# Altium project smove.PrjPcb
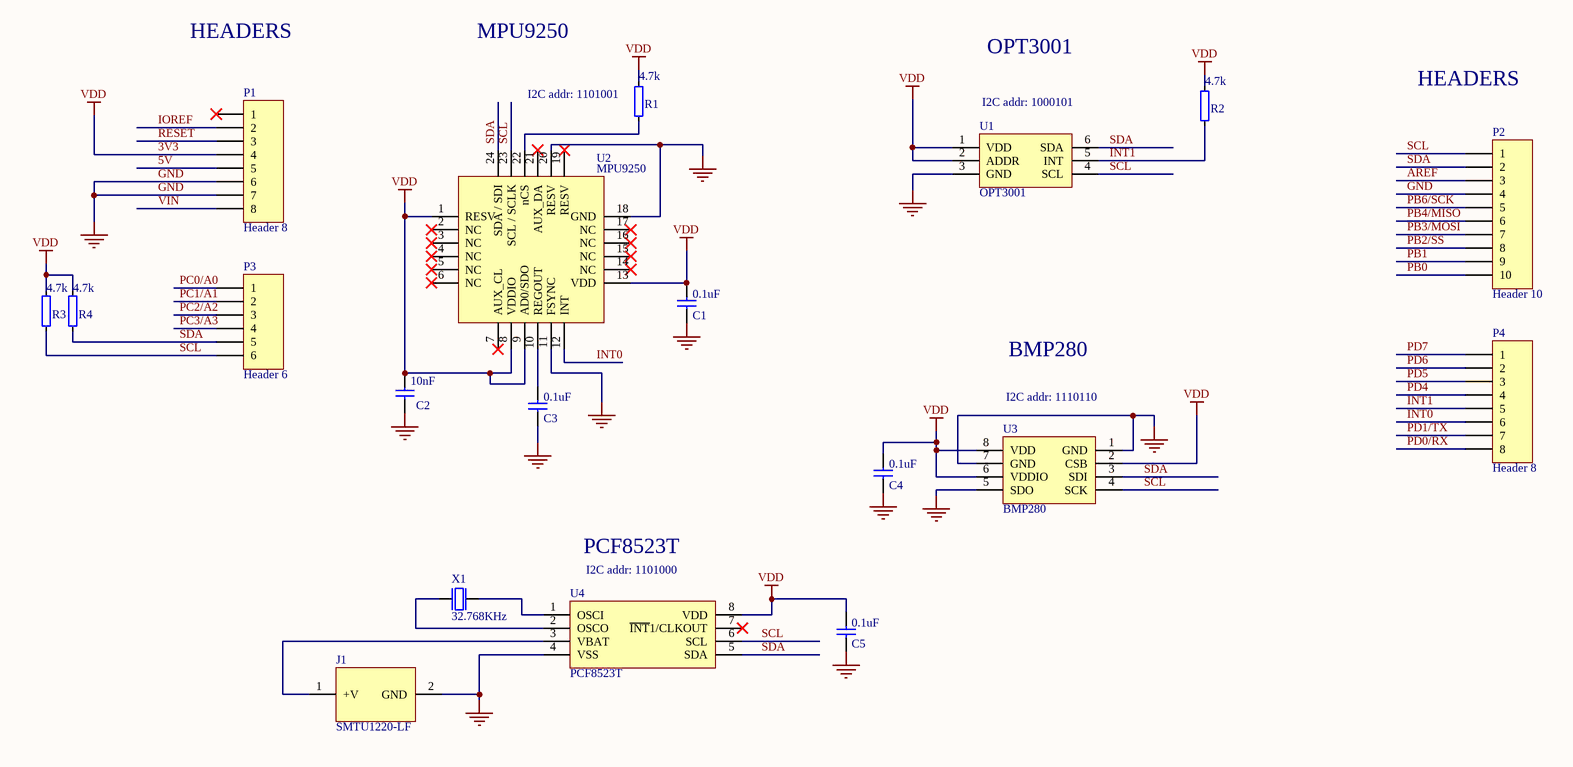
[diagram p0: Sheet1.SchDoc]
1 sheet, 19 parts. Net scope: global (net labels, ports and power ports of the same name join across sheets).
Board file: PCB1.PcbDoc

## Sheet Sheet1.SchDoc
size A3

### Parts
C1  0.1uF  [CAPC1608X06L]
C2  10nF  [CAPC1608X06L]
C3  0.1uF  [CAPC1608X06L]
C4  0.1uF  [CAPC1608X06L]
C5  0.1uF  [CAPC1608X06L]
J1  SMTU1220-LF  [SMTU1220-LF]
P1  Header 8  [HDR1X8]
P2  Header 10  [HDR1X10]
P3  Header 6  [HDR1X6]
P4  Header 8  [HDR1X8]
R1  4.7k  [RESC1608X06N]
R2  4.7k  [RESC1608X06N]
R3  4.7k  [RESC1608X06N]
R4  4.7k  [RESC1608X06N]
U1  OPT3001  [SON65P200X65_HS-7N]
U2  MPU9250  [QFN40P300X300X105_HS-25N]
U3  BMP280  [SON65P200X100-8N]
U4  PCF8523T  [SOIC127P600X175-8N]
X1  32.768KHz  [XTAL_3215]

### Nets
3V3: C1.2 C2.2 C4.2 C5.2 P1.4 R1.2 R2.2 R3.2 R4.2 U1.1(VDD) U1.2(ADDR) U2.1(RESV) U2.8(VDDIO) U2.9(AD0/SDO) U2.13(VDD) U3.2(CSB) U3.6(VDDIO) U3.8(VDD) U4.8(VDD)  [also labelled VDD]
GND: C1.1 C2.1 C3.1 C4.1 C5.1 J1.2(GND) P1.6 P1.7 P2.4 U1.3(GND) U2.11(FSYNC) U2.18(GND) U2.20(RESV) U3.1(GND) U3.5(SDO) U3.7(GND) U4.4(VSS)
5V: P1.5
AREF: P2.3
INT0: P4.6 U2.12(INT)
INT1: P4.5 R2.1 U1.5(INT)
IOREF: P1.2
PB0: P2.10
PB1: P2.9
PB2/SS: P2.8
PB3/MOSI: P2.7
PB4/MISO: P2.6
PB6/SCK: P2.5
PC0/A0: P3.1
PC1/A1: P3.2
PC2/A2: P3.3
PC3/A3: P3.4
PD0/RX: P4.8
PD1/TX: P4.7
PD4: P4.4
PD5: P4.3
PD6: P4.2
PD7: P4.1
RESET: P1.3
SCL: P2.1 P3.6 R3.1 U1.4(SCL) U2.23(SCL_/_SCLK) U3.4(SCK) U4.6(SCL)
SDA: P2.2 P3.5 R4.1 U1.6(SDA) U2.24(SDA_/_SDI) U3.3(SDI) U4.5(SDA)
VIN: P1.8
NetC3_2: C3.2 U2.10(REGOUT)
NetJ1_1: J1.1(+V) U4.3(VBAT)
NetR1_1: R1.1 U2.22(nCS)
NetU4_1: U4.1(OSCI) X1.2(out)
NetU4_2: U4.2(OSCO) X1.1(inp)

Not connected (* = marked no-connect by the designer): P1 1*; U2 2(NC)* 3(NC)* 4(NC)* 5(NC)* 6(NC)* 7(AUX_CL)* 14(NC)* 15(NC)* 16(NC)* 17(NC)* 19(RESV)* 21(AUX_DA)*; U4 7(~{INT}1/CLKOUT)*

### Notes on the sheet
- HEADERS
- MPU9250
- (near R1) I2C addr: 1101001
- OPT3001
- (near U1) I2C addr: 1000101
- BMP280
- (near U3) I2C addr: 1110110
- PCF8523T
- (near U4) I2C addr: 1101000

### Library data of the parts
C1-C5 = CAP_0603
J1 = COIN_CELL
P1 P4 = Header 8: Header, 8-Pin; LatestRevisionDate: 17-Jul-2002; LatestRevisionNote: Re-released for DXP Platform.; Publisher: Altium Limited
P2 = Header 10: Header, 10-Pin; LatestRevisionDate: 17-Jul-2002; LatestRevisionNote: Re-released for DXP Platform.; Publisher: Altium Limited
P3 = Header 6: Header, 6-Pin; LatestRevisionDate: 17-Jul-2002; LatestRevisionNote: Re-released for DXP Platform.; Publisher: Altium Limited
R1-R4 = RES_0603
X1 = XTAL_3215: 32.768KHZ ±20PPM,9.0PF - CRYSTAL, SM, WATCH